# Altium schematic sheet Arduino UNO.SchDoc: Arduino UNO project
size A2; DrawnBy: KroNton
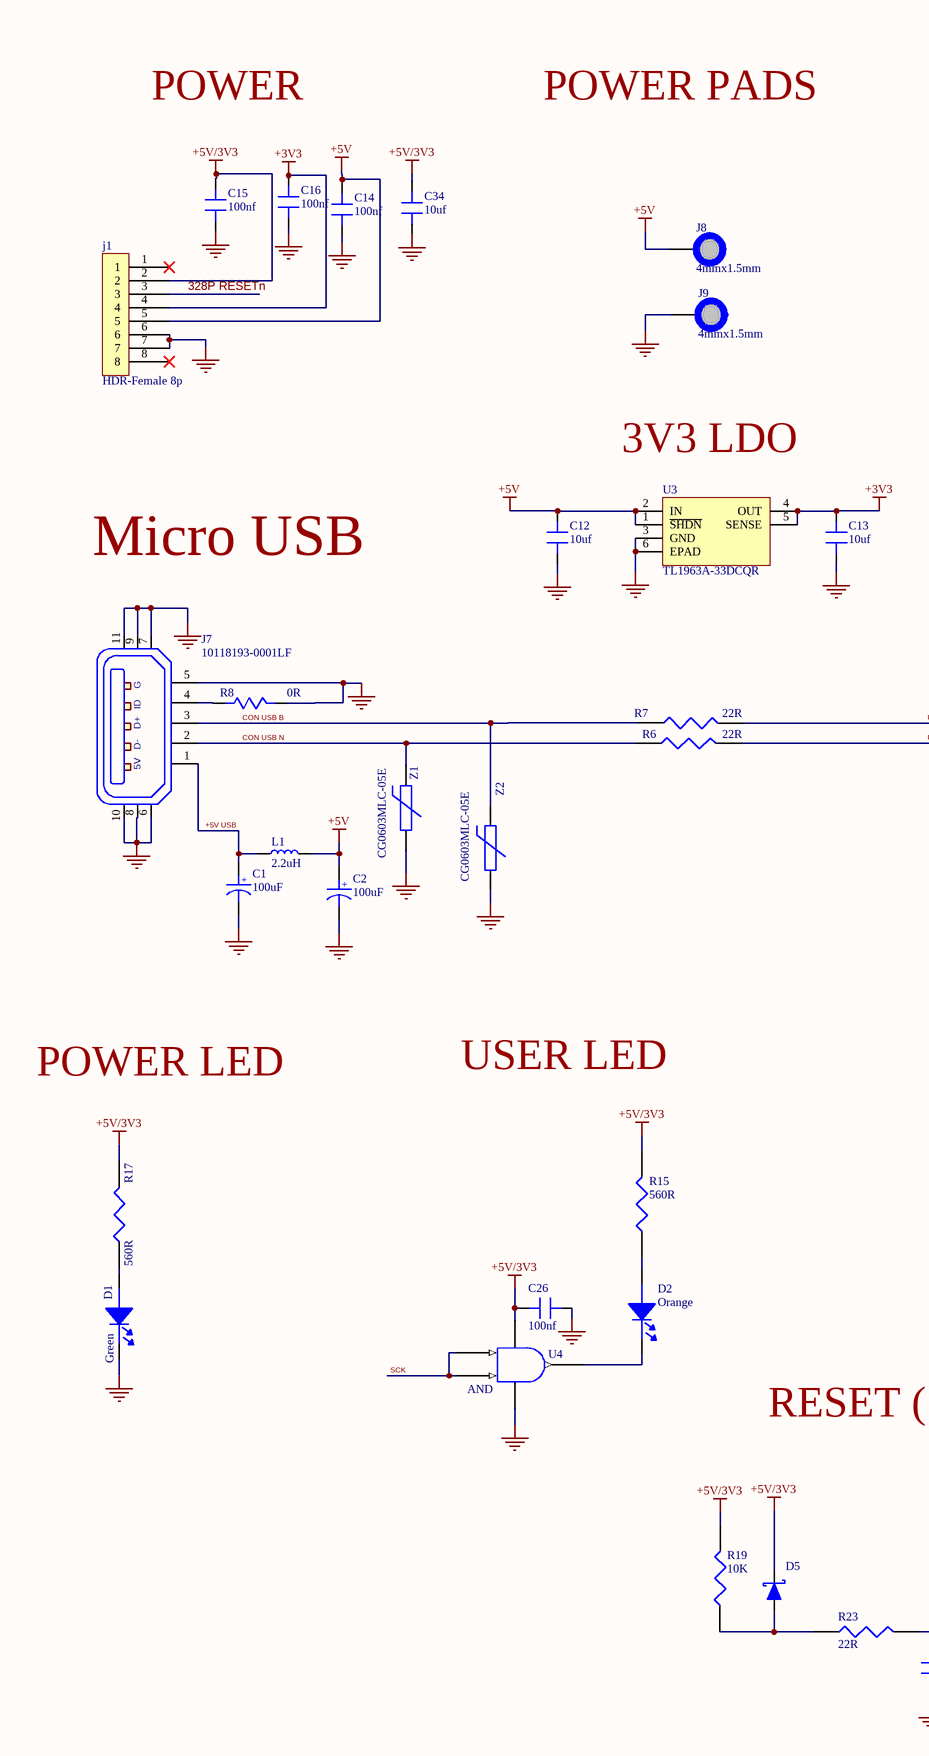
[diagram p0: Arduino UNO.SchDoc, left]
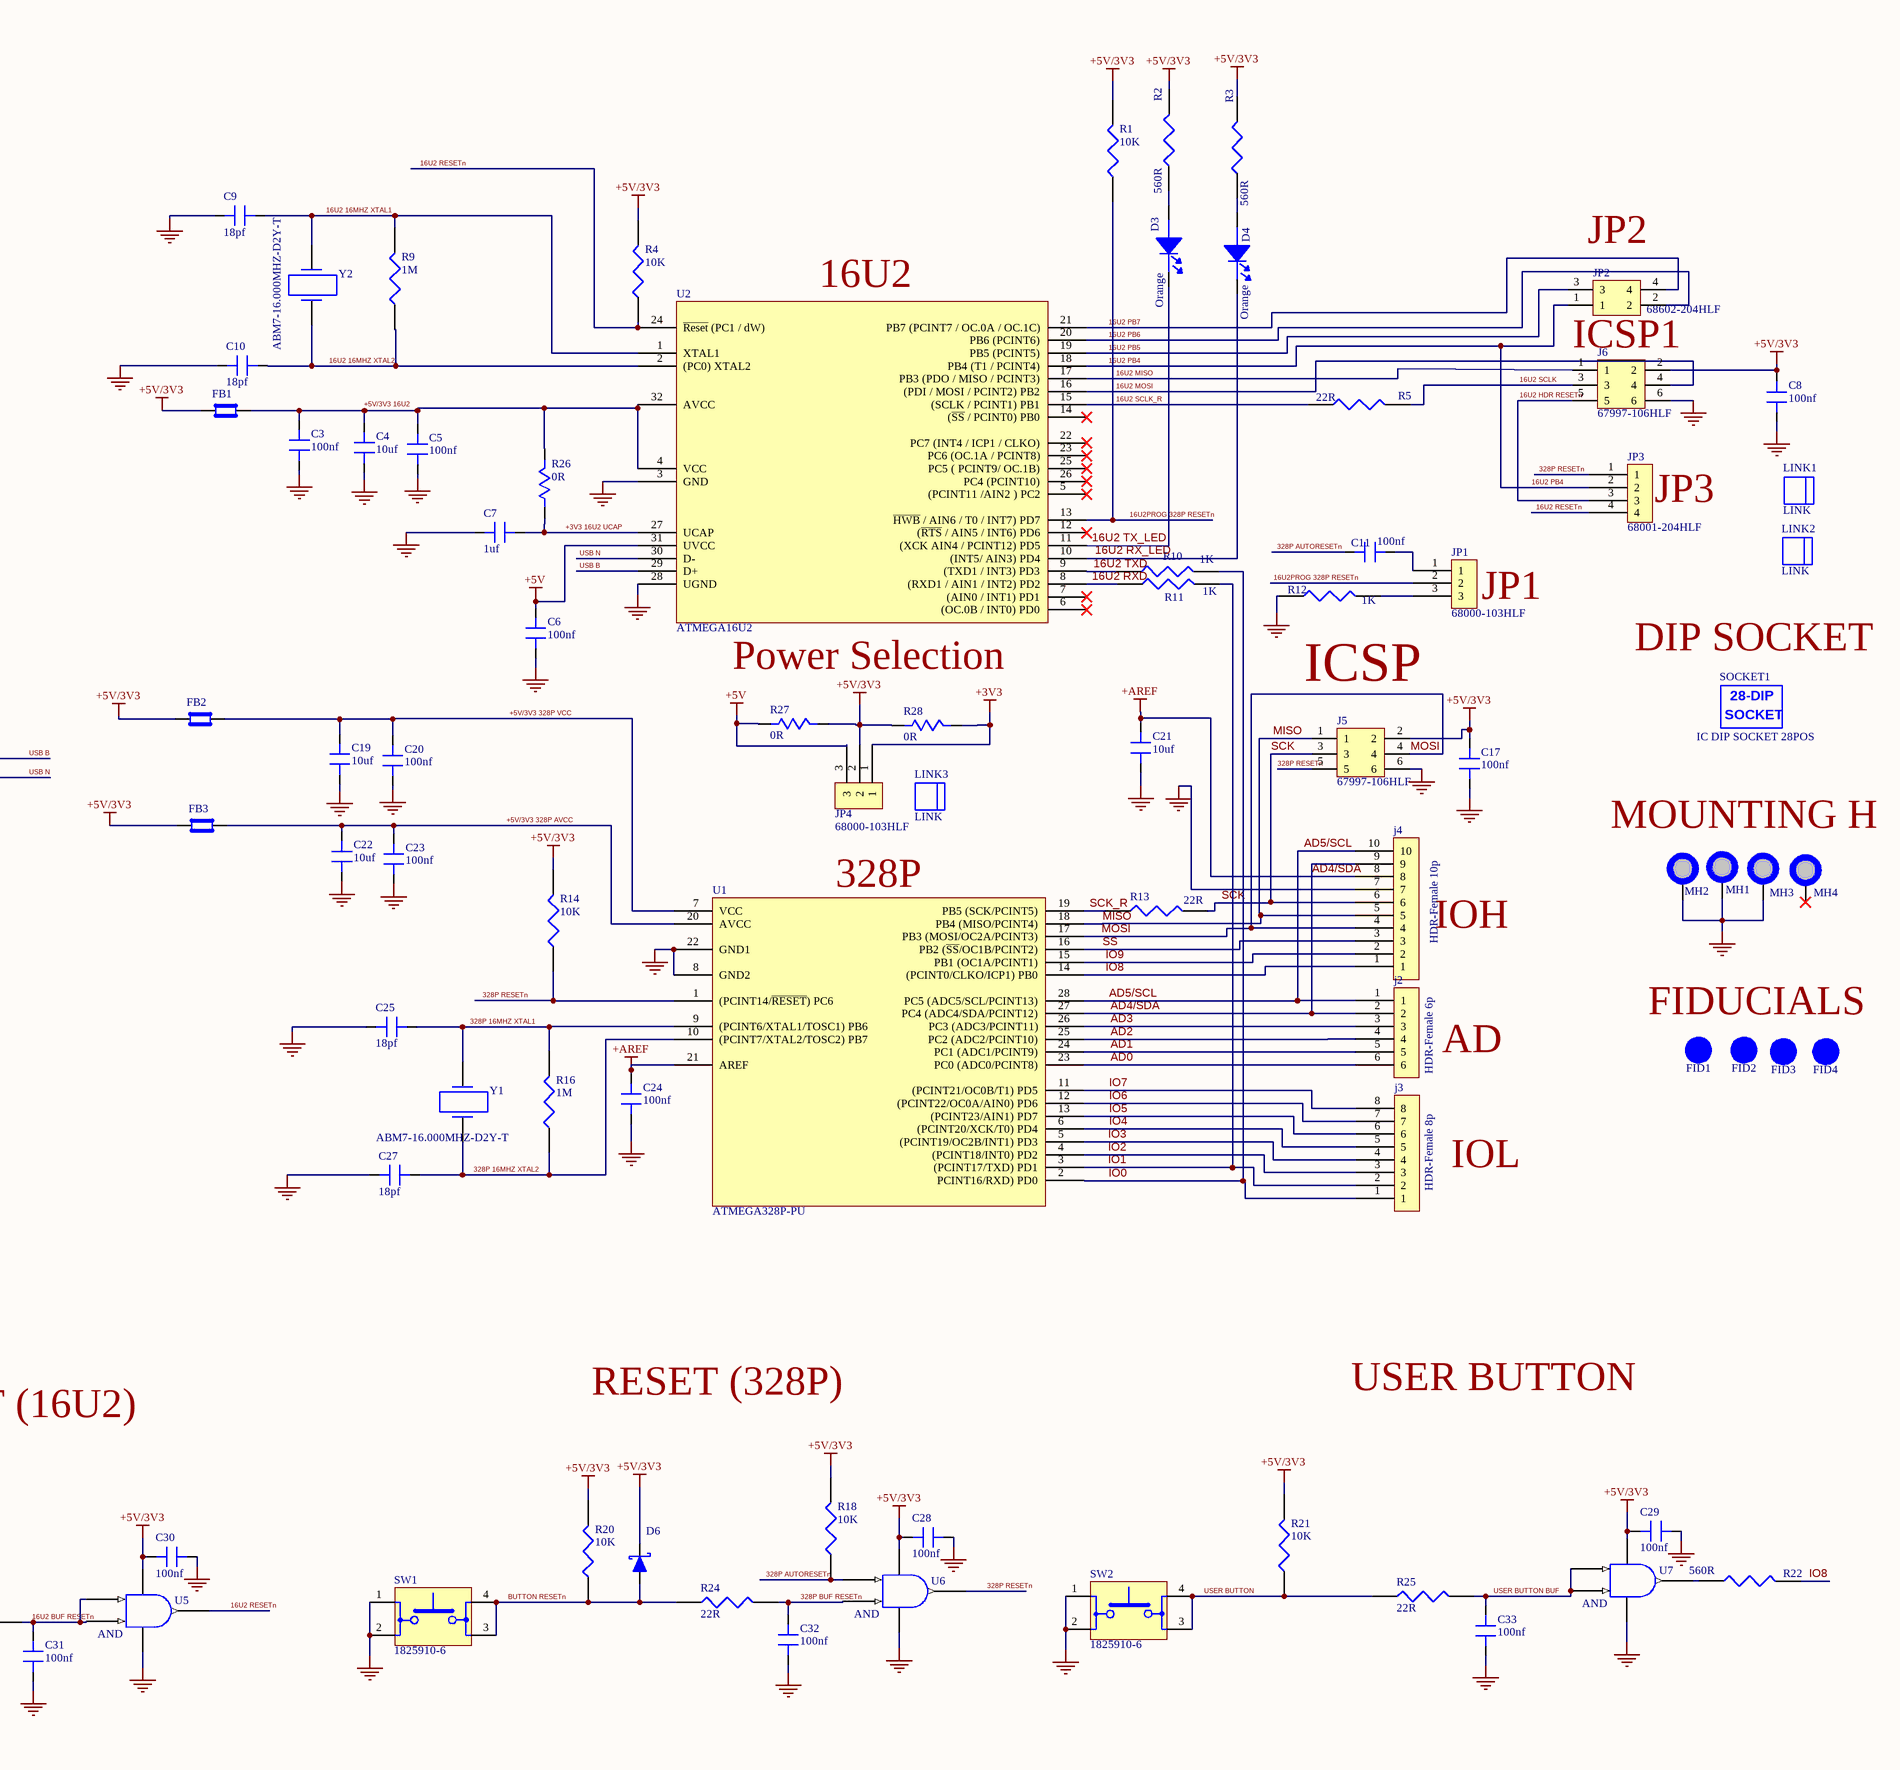
[diagram p1: Arduino UNO.SchDoc, right]

## Parts
C1  100uF  [C_Alaminum_C size]
C2  100uF  [C_Alaminum_C size]
C3  100nf  [C0805]
C4  10uf  [C 10uf/16v]
C5  100nf  [C0805]
C6  100nf  [C0805]
C7  1uf  [C0805]
C8  100nf  [C0805]
C9  18pf  [C0805]
C10  18pf  [C0805]
C11  100nf  [C0805]
C12  10uf  [C 10uf/16v]
C13  10uf  [C 10uf/16v]
C14  100nf  [C0805]
C15  100nf  [C0805]
C16  100nf  [C0805]
C17  100nf  [C0805]
C19  10uf  [C 10uf/16v]
C20  100nf  [C0805]
C21  10uf  [C 10uf/16v]
C22  10uf  [C 10uf/16v]
C23  100nf  [C0805]
C24  100nf  [C0805]
C25  18pf  [C0805]
C26  100nf  [C0805]
C27  18pf  [C0805]
C28  100nf  [C0805]
C29  100nf  [C0805]
C30  100nf  [C0805]
C31  100nf  [C0805]
C32  100nf  [C0805]
C33  100nf  [C0805]
C34  10uf  [C 10uf/16v]
D1  Green  [LED_0603]
D2  Orange  [LED_0603]
D3  Orange  [LED_0603]
D4  Orange  [LED_0603]
D5  BAT54HT1G  [SOD323]  (value not drawn)
D6  BAT54HT1G  [SOD323]  (value not drawn)
FB1  MPZ2012S601AT000  [FB-2A]  (value not drawn)
FB2  MPZ2012S601AT000  [FB-2A]  (value not drawn)
FB3  MPZ2012S601AT000  [FB-2A]  (value not drawn)
FID1  1mm  [FID 40x120D]  (value not drawn)
FID2  1mm  [FID 40x120D]  (value not drawn)
FID3  1mm  [FID 40x120D]  (value not drawn)
FID4  1mm  [FID 40x120D]  (value not drawn)
j1  HDR-Female 8p  [HDR-Female 8p]
j2  HDR-Female 6p  [HDR-Female 6p]
j3  HDR-Female 8p  [HDR-Female 8p]
j4  HDR-Female 10p  [HDR-Female 10p]
J5  67997-106HLF  [2x3 Male Header]
J6  67997-106HLF  [2x3 Male Header]
J7  10118193-0001LF  [USB]
J8  4mmx1.5mm  [Pad With Hole 4mmx1.5mm]  (no BOM)
J9  4mmx1.5mm  [Pad With Hole 4mmx1.5mm]  (no BOM)
JP1  68000-103HLF  [HDR-male 3p]
JP2  68602-204HLF  [2x2 Male Header]
JP3  68001-204HLF  [HDR-male 4p]
JP4  68000-103HLF  [HDR-male 3p]
L1  2.2uH  [C1210 IND]
LINK1  LINK  (mechanical)
LINK2  LINK  (mechanical)
LINK3  LINK  (mechanical)
MH1  MH7.4mm_3.2mm  [MH7.4mm_3.2mm]  (value not drawn)  (no BOM)
MH2  MH7.4mm_3.2mm  [MH7.4mm_3.2mm]  (value not drawn)  (no BOM)
MH3  MH7.4mm_3.2mm  [MH7.4mm_3.2mm]  (value not drawn)  (no BOM)
MH4  MH7.4mm_3.2mmNPL  [MH7.4mm_3.2mm NOCupper]  (value not drawn)  (no BOM)
R1  10K  [R0805]
R2  560R  [R0805]
R3  560R  [R0805]
R4  10K  [R0805]
R5  22R  [R0805]
R6  22R  [R0805]
R7  22R  [R0805]
R8  0R  [R0805]
R9  1M  [R0805]
R10  1K  [R0805]
R11  1K  [R0805]
R12  1K  [R0805]
R13  22R  [R0805]
R14  10K  [R0805]
R15  560R  [R0805]
R16  1M  [R0805]
R17  560R  [R0805]
R18  10K  [R0805]
R19  10K  [R0805]
R20  10K  [R0805]
R21  10K  [R0805]
R22  560R  [R0805]
R23  22R  [R0805]
R24  22R  [R0805]
R25  22R  [R0805]
R26  0R  [R0805]
R27  0R  [R0805]
R28  0R  [R0805]
SOCKET1  IC DIP SOCKET 28POS  [IC DIP SOCKET 28POS]
SW1  1825910-6  [SWITCH TACTILE]
SW2  1825910-6  [SWITCH TACTILE]
U1  ATMEGA328P-PU  [ATMEGA328P-PU]
U2  ATMEGA16U2  [TQFP32]
U3  TL1963A-33DCQR  [DCQ 3.3 Reg]
U4  IC GATE AND 1CH 2-INP SOT23-5  [DBV_SOT_23_5]  (value not drawn)
U5  IC GATE AND 1CH 2-INP SOT23-5  [DBV_SOT_23_5]  (value not drawn)
U6  IC GATE AND 1CH 2-INP SOT23-5  [DBV_SOT_23_5]  (value not drawn)
U7  IC GATE AND 1CH 2-INP SOT23-5  [DBV_SOT_23_5]  (value not drawn)
Y1  ABM7-16.000MHZ-D2Y-T  [ABM7-16.000MHZ]
Y2  ABM7-16.000MHZ-D2Y-T  [ABM7-16.000MHZ]
Z1  CG0603MLC-05E  [R0603]
Z2  CG0603MLC-05E  [R0603]

## Nets
+3V3: C13.12 C16.12 j1.4 JP4.1 R28.1 U3.4(OUT) U3.5(SENSE)
+5V: C2.1 C6.12 C12.12 C14.12 j1.5 J8.1 JP4.3 L1.4 R27.2 U2.31(UVCC) U3.1(~{SHDN}) U3.2(IN)
+5V/3V3: C8.12 C15.12 C17.12 C26.12 C28.12 C29.12 C30.12 C34.12 D5.cathode D6.cathode FB1.2 FB2.2 FB3.2 j1.2 J5.2 J6.2 JP4.2 R1.1 R2.1 R3.1 R4.1 R14.1 R15.1 R17.1 R18.1 R19.1 R20.1 R21.1 R27.1 R28.2 U4.5 U5.5 U6.5 U7.5
AD4/SDA: C21.12 C24.12 j2.2 j4.8 j4.9 U1.21(AREF) U1.27(PC4_(ADC4/SDA/PCINT12))  [also labelled +AREF]
GND: C1.2 C2.2 C3.11 C4.11 C5.11 C6.11 C7.11 C8.11 C9.12 C10.12 C12.11 C13.11 C14.11 C15.11 C16.11 C17.11 C19.11 C20.11 C21.11 C22.11 C23.11 C24.11 C25.12 C26.11 C27.12 C28.11 C29.11 C30.11 C31.11 C32.11 C33.11 C34.11 D1.1 j1.6 j1.7 j4.7 J5.6 J6.6 J7.5 J7.6 J7.7 J7.8 J7.9 J7.10 J7.11 J9.1 MH1.1 MH2.1 MH3.1 R8.1 R12.2 SW1.1 SW1.2 SW2.1 SW2.2 U1.8(GND2) U1.22(GND1) U2.3(GND) U2.28(UGND) U3.3(GND) U3.6(EPAD) U4.3 U5.3 U6.3 U7.3 Z1.2 Z2.2
16U2 16MHZ XTAL1: C9.11 R9.1 U2.1(XTAL1) Y2.4
16U2 16MHZ XTAL2: C10.11 R9.2 U2.2((PC0)_XTAL2) Y2.3
16U2 BUF RESETn: C31.12 R23.1 U5.1 U5.2
16U2 HDR RESETn: J6.5 JP3.3
16U2 MISO: J6.1 U2.17(PB3_(PDO_/_MISO_/_PCINT3))
16U2 MOSI: J6.4 U2.16((PDI_/_MOSI_/_PCINT2)_PB2)
16U2 PB4: JP2.1 JP3.2 U2.18(PB4_(T1_/_PCINT4))
16U2 PB5: JP2.3 U2.19(PB5_(PCINT5))
16U2 PB6: JP2.2 U2.20(PB6_(PCINT6))
16U2 PB7: JP2.4 U2.21(PB7_(PCINT7_/_OC.0A_/_OC.1C))
16U2 RESETn: JP3.4 R4.2 U2.24(~{Reset}_(PC1_/_dW)) U5.4
16U2 RX_LED: D4.1 U2.10((INT5/_AIN3)_PD4)
16U2 RXD: R11.2 U2.8((RXD1_/_AIN1_/_INT2)_PD2)
16U2 SCLK: J6.3 R5.1
16U2 SCLK_R: R5.2 U2.15((SCLK_/_PCINT1)_PB1)
16U2 TX_LED: D3.1 U2.11((XCK_AIN4_/_PCINT12)_PD5)
16U2 TXD: R10.2 U2.9((TXD1_/_INT3)_PD3)
16U2PROG 328P RESETn: JP1.2 R1.2 U2.13(~{HWB}_/_AIN6_/_T0_/_INT7)_PD7)
328P 16MHZ XTAL1: C25.11 R16.1 U1.9((PCINT6/XTAL1/TOSC1)_PB6) Y1.4
328P 16MHZ XTAL2: C27.11 R16.2 U1.10((PCINT7/XTAL2/TOSC2)_PB7) Y1.3
328P AUTORESETn: C11.12 R18.2 U6.1
328P BUF RESETn: C32.12 R24.1 U6.2
328P RESETn: j1.3 J5.5 JP3.1 R14.2 U1.1((PCINT14/~{RESET})_PC6) U6.4
+3V3 16U2 UCAP: C7.12 R26.2 U2.27(UCAP)
+5V USB: C1.1 J7.1 L1.3
+5V/3V3 328P AVCC: C22.12 C23.12 FB3.1 U1.20(AVCC)
+5V/3V3 328P VCC: C19.12 C20.12 FB2.1 U1.7(VCC)
AD0: j2.6 U1.23(PC0_(ADC0/PCINT8))
AD1: j2.5 U1.24(PC1_(ADC1/PCINT9))
AD2: j2.4 U1.25(PC2_(ADC2/PCINT10))
AD3: j2.3 U1.26(PC3_(ADC3/PCINT11))
AD5/SCL: j2.1 j4.10 U1.28(PC5_(ADC5/SCL/PCINT13))
BUTTON RESETn: D6.anode R20.2 R24.2 SW1.3 SW1.4
CON USB B: J7.3 R7.2 Z2.1
CON USB N: J7.2 R6.2 Z1.1
IO0: j3.1 R10.1 U1.2(PCINT16/RXD)_PD0)
IO1: j3.2 R11.1 U1.3((PCINT17/TXD)_PD1)
IO2: j3.3 U1.4((PCINT18/INT0)_PD2)
IO3: j3.4 U1.5((PCINT19/OC2B/INT1)_PD3)
IO4: j3.5 U1.6((PCINT20/XCK/T0)_PD4)
IO5: j3.6 U1.13((PCINT23/AIN1)_PD7)
IO6: j3.7 U1.12((PCINT22/OC0A/AIN0)_PD6)
IO7: j3.8 U1.11((PCINT21/OC0B/T1)_PD5)
IO8: j4.1 R22.1 U1.14((PCINT0/CLKO/ICP1)_PB0)
IO9: j4.2 U1.15(PB1_(OC1A/PCINT1))
MISO: j4.5 J5.1 U1.18(PB4_(MISO/PCINT4))
MOSI: j4.4 J5.4 U1.17(PB3_(MOSI/OC2A/PCINT3))
SCK: j4.6 J5.3 R13.1 U4.1 U4.2
SCK_R: R13.2 U1.19(PB5_(SCK/PCINT5))
SS: j4.3 U1.16(PB2_(~{SS}/OC1B/PCINT2))
USB B: R7.1 U2.29(D+)
USB N: R6.1 U2.30(D-)
USER BUTTON: R21.2 R25.2 SW2.3 SW2.4
USER BUTTON BUF: C33.12 R25.1 U7.1 U7.2
NetC3_12: C3.12 C4.12 C5.12 FB1.1 R26.1 U2.4(VCC) U2.32(AVCC)
NetC11_11: C11.11 JP1.1
NetD1_2: D1.2 R17.2
NetD2_1: D2.1 U4.4
NetD2_2: D2.2 R15.2
NetD3_2: D3.2 R2.2
NetD4_2: D4.2 R3.2
NetD5_anode: D5.anode R19.2 R23.2
NetJ7_4: J7.4 R8.2
NetJP1_3: JP1.3 R12.1
NetR22_2: R22.2 U7.4

Not connected (* = marked no-connect by the designer): j1 1* 8*; MH4 1*; U2 5((PCINT11_/AIN2_)_PC2)* 6((OC.0B_/_INT0)_PD0)* 7((AIN0_/_INT1)_PD1)* 12((~{RTS}_/_AIN5_/_INT6)_PD6)* 14((~{SS}_/_PCINT0)_PB0)* 22(PC7_(INT4_/_ICP1_/_CLKO))* 23(PC6_(OC.1A_/_PCINT8))* 25(PC5_(_PCINT9/_OC.1B))* 26(PC4_(PCINT10))*

## Notes on the sheet
- POWER
- POWER PADS
- (near U2) 16U2
- (near JP2) JP2
- ICSP1
- (near U3) 3V3 LDO
- (near JP3) JP3
- Micro USB
- (near JP1) JP1
- (near U2) Power Selection
- DIP SOCKET
- ICSP
- MOUNTING H
- (near U1) 328P
- (near j4) IOH
- AD
- FIDUCIALS
- POWER LED
- USER LED
- IOL
- RESET (16U2)
- RESET (328P)
- USER BUTTON
- Labels drawn without touching a wire or pin: +5V/3V3 16U2
- (in symbol C100uF/10v) +
- (in symbol IC DIP SOCKET 28POS) 28-DIP; SOCKET
- (in symbol IC GATE AND 1CH 2-INP SOT23-5) AND
- (in symbol USB) G; ID; D+; D-; 5V

## Library data of the parts
C1 C2 = C100uF/10v: Supplier 1: Digi-Key; Supplier Part Number 1: PCE3867CT-ND
C3 C5 C6 C8 C11 C14-C17 C20 C23 C24 C26 C28-C33 = C0805: Supplier 1: Digi-Key; Supplier Part Number 1: 399-1170-6-ND
C4 C12 C13 C19 C21 C22 C34 = C-10uf/16v: Supplier 1: Digi-Key; Supplier Part Number 1: 445-4115-2-ND
C7 = C 1uf: Supplier 1: Digi-Key; Supplier Part Number 1: 445-1419-1-ND
C9 C10 C25 C27 = C0805/18pf: Supplier 1: Digi-Key; Supplier Part Number 1: 399-1112-1-ND
D1 = Green  Led -SMD: Supplier 1: Digi-Key; Supplier Part Number 1: 475-2709-6-ND
D2-D4 = Orange  Led -SMD: Supplier 1: Digi-Key; Supplier Part Number 1: 475-2740-1-ND
D5 D6 = Schottky Diode: Supplier 1: Digi-Key; Supplier Part Number 1: BAT54HT1GOSCT-ND
FB1-FB3 = FB-2A: Supplier 1: Digi-Key; Supplier Part Number 1: 445-2206-6-ND
FID1-FID4 = FID 1mm
J5 J6 = HDR-Male2x3p: Supplier 1: Digi-Key; Supplier Part Number 1: 609-3393-ND
J7 = USB: Supplier 1: Digi-Key; Supplier Part Number 1: 609-4616-1-ND
J8 J9 = PAD WITH HOLE
JP1 JP4 = HDR-Male1x3p: Supplier 1: Digi-Key; Supplier Part Number 1: 609-3461-ND
JP2 = HDR-Male2x2p: Supplier 1: Digi-Key; Supplier Part Number 1: 609-3369-ND
JP3 = HDR-Male1x4p: Supplier 1: Digi-Key; Supplier Part Number 1: 609-3402-ND
L1 = Inductor 2A 80mOhm: Supplier 1: Digi-Key; Supplier Part Number 1: 399-9598-1-ND
LINK1-LINK3 = CONN JUMPER SHORTING: Supplier 1: Digi-Key; Supplier Part Number 1: S9337-ND
R1 R4 R14 R18-R21 = 10KR0805: Supplier 1: Digi-Key; Supplier Part Number 1: 311-10.0KCRCT-ND
R2 R3 R15 R17 R22 = 560R0805: Supplier 1: Digi-Key; Supplier Part Number 1: 311-560CRCT-ND
R5-R7 R13 R23-R25 = 22R0805: Supplier 1: Digi-Key; Supplier Part Number 1: YAG3713DKR-ND
R8 R26-R28 = 0R0805: Supplier 1: Digi-Key; Supplier Part Number 1: 311-0.0ARCT-ND
R9 R16 = 1MR0805: Supplier 1: Digi-Key; Supplier Part Number 1: 311-1.00MCRCT-ND
R10-R12 = 1KR0805: Supplier 1: Digi-Key; Supplier Part Number 1: 311-1.00KCRCT-ND
SW1 SW2 = SWITCH TACTILE: Supplier 1: Digi-Key; Supplier Part Number 1: 450-1650-ND
U1 = ATMEGA328P: Supplier 1: Digi-Key; Supplier Part Number 1: ATMEGA328P-PU-ND
U3 = IC REG LINEAR 3.3V: Supplier 1: Digi-Key; Supplier Part Number 1: 296-24534-1-ND
Y1 Y2 = 16MH.Z crystal: Supplier 1: Digi-Key; Supplier Part Number 1: 535-9840-1-ND
Z1 Z2 = VARISTOR 0603: Supplier 1: Digi-Key; Supplier Part Number 1: CG0603MLC-05ECT-ND
j1 j3 = HDR-Female 8p: Supplier 1: Digi-Key; Supplier Part Number 1: 952-1809-ND
j2 = HDR-Female 6p: Supplier 1: Digi-Key; Supplier Part Number 1: 952-1809-ND
j4 = HDR-Female 10p: Supplier 1: Digi-Key; Supplier Part Number 1: 952-1847-ND
SOCKET1 = IC DIP SOCKET 28POS: Supplier 1: Digi-Key; Supplier Part Number 1: 3M5480-ND
U2 = ATMEGA16U2: Supplier 1: Digi-Key; Supplier Part Number 1: ATMEGA16U2-AU-ND
U4-U7 = IC GATE AND 1CH 2-INP SOT23-5: Supplier 1: Digi-Key; Supplier Part Number 1: 296-29202-1-ND